# Altium schematic sheet DE-140824.SchDoc: TriacBaeBoard
size A3; Author: eldar6776@hotmail.com; DrawnBy: Eldar Dedic; Organization: JUBERA d.o.o.; Address1: Braće Mulić 81; Address2: 71000 Sarajevo; Address3: Federacija BiH; Address4: Bosna i Hercegovina; DocumentNumber: DE-140824; Revision: 001; SheetNumber: 1; SheetTotal: 2
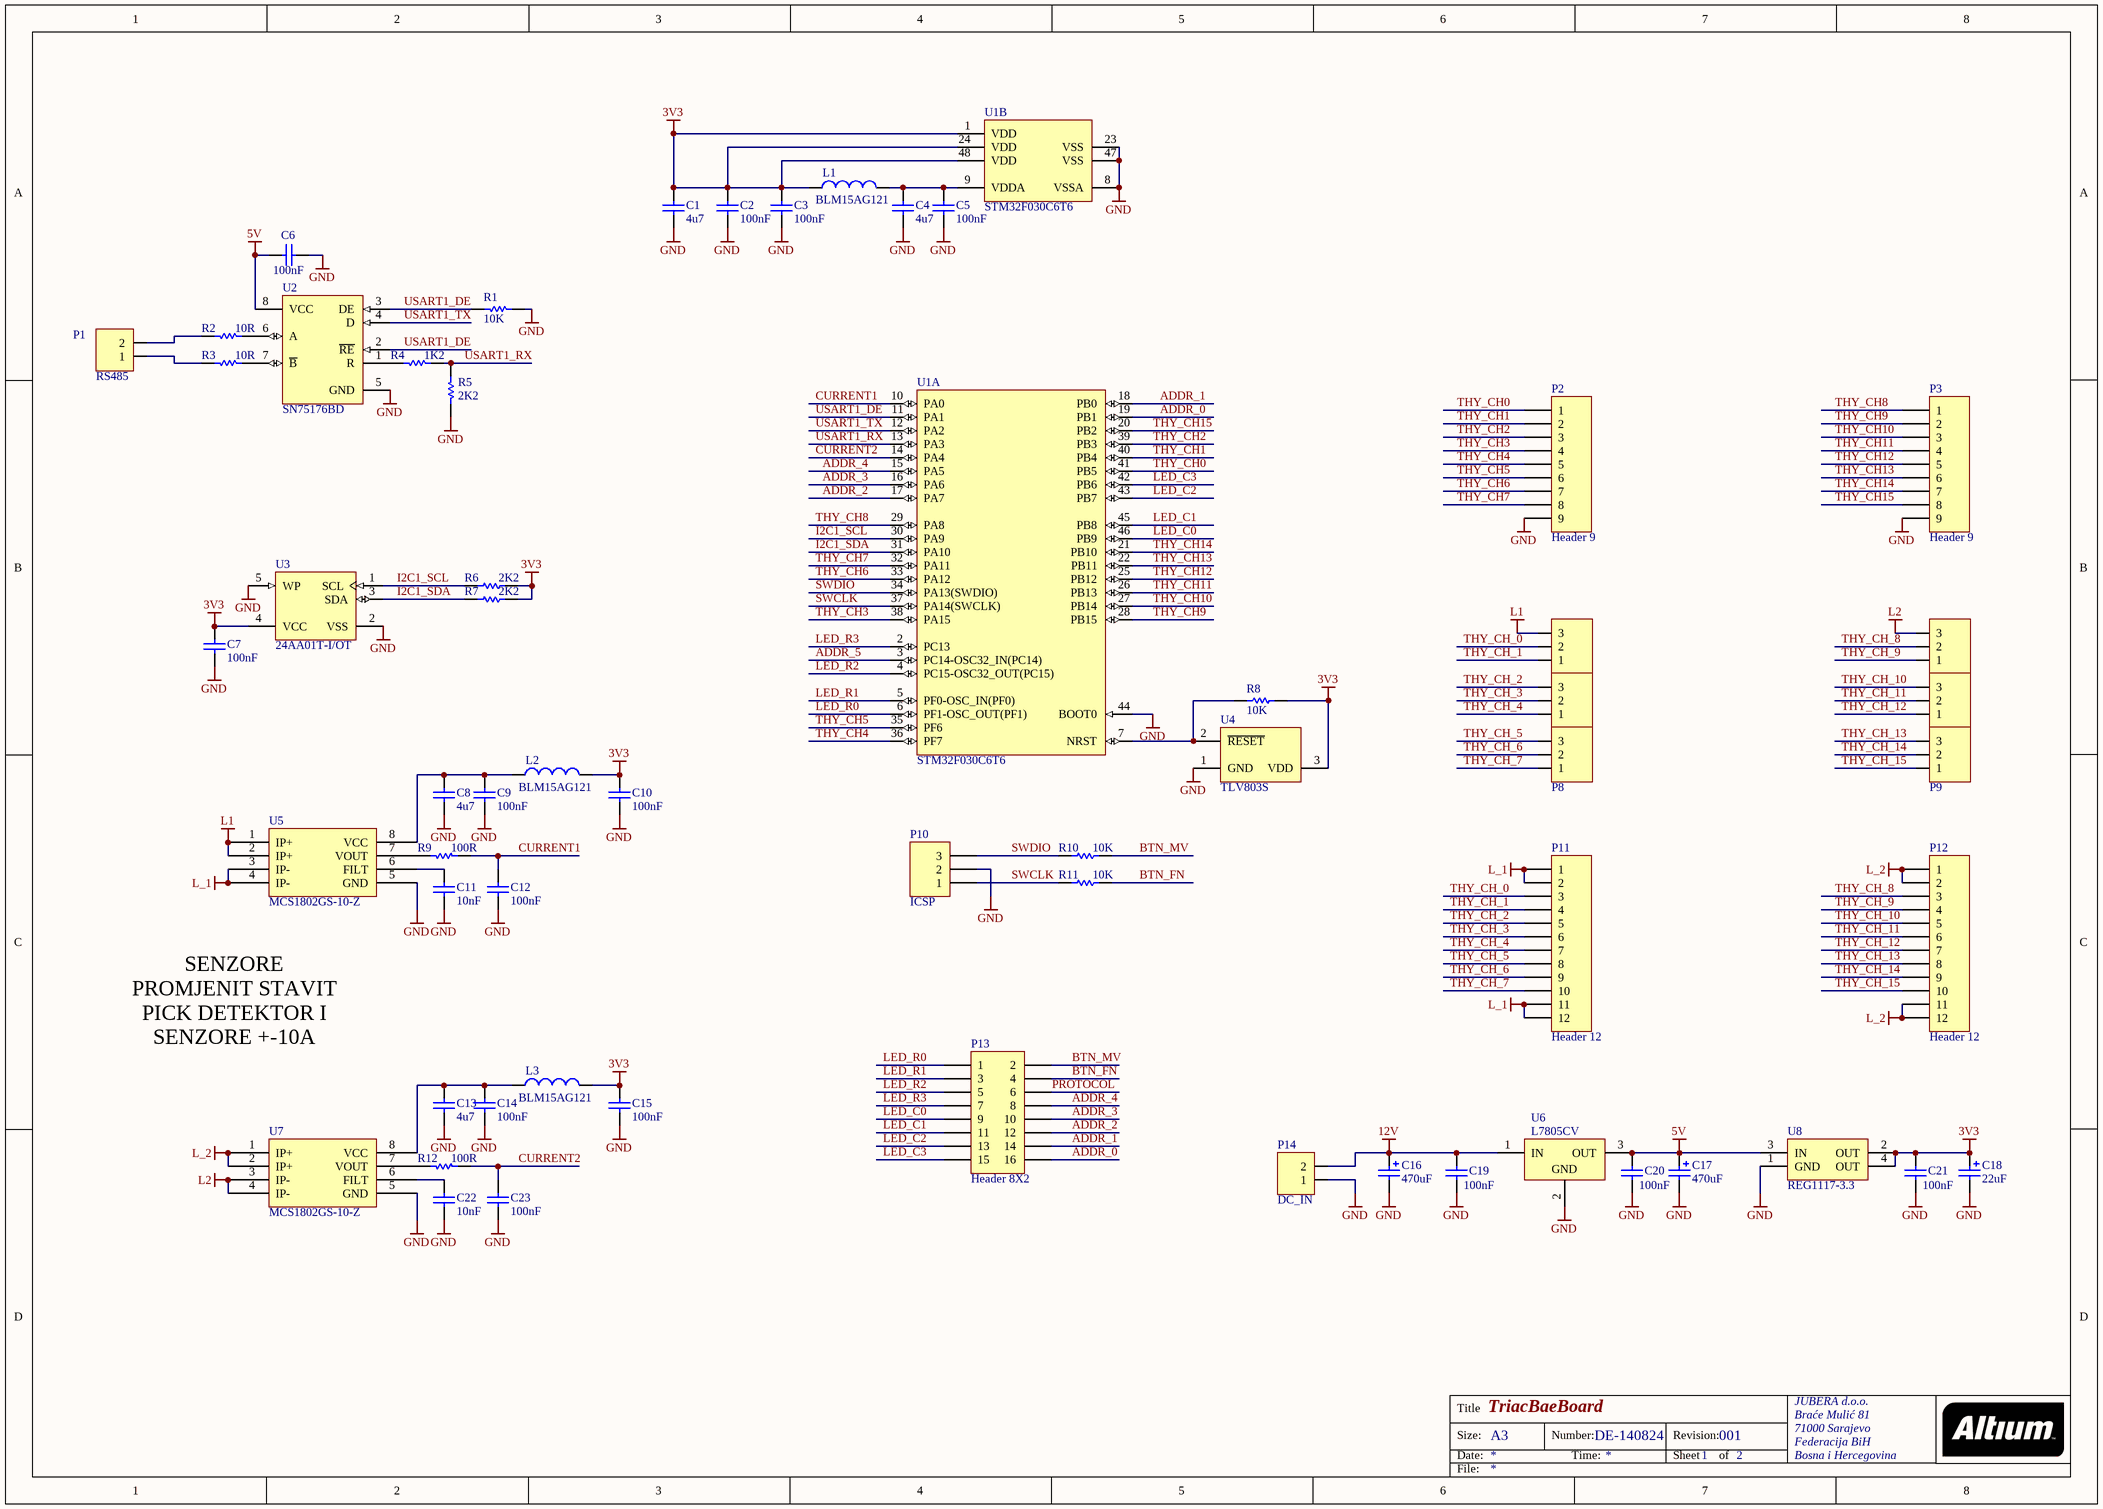
[diagram p0: DE-140824.SchDoc]

## Parts
C1  value 4u7  [0805]  (hidden comment: C0805)
C2  value 100nF  [0603]  (hidden comment: C0603)
C3  value 100nF  [0603]  (hidden comment: C0603)
C4  value 4u7  [0805]  (hidden comment: C0805)
C5  value 100nF  [0603]  (hidden comment: C0603)
C6  100nF  [0603]
C7  value 100nF  [0603]  (hidden comment: C0603)
C8  value 4u7  [0805]  (hidden comment: C0805)
C9  value 100nF  [0603]  (hidden comment: C0603)
C10  value 100nF  [0603]  (hidden comment: C0603)
C11  value 10nF  [0603]  (hidden comment: C0603)
C12  value 100nF  [0603]  (hidden comment: C0603)
C13  value 4u7  [0805]  (hidden comment: C0805)
C14  value 100nF  [0603]  (hidden comment: C0603)
C15  value 100nF  [0603]  (hidden comment: C0603)
C16  470uF  [CAPPR5-10X12.5]
C17  470uF  [CAPPR5-10X12.5]
C18  22uF  [CAPPR2-5X11]
C19  100nF  [0603]
C20  100nF  [0603]
C21  100nF  [0603]
C22  value 10nF  [0603]  (hidden comment: C0603)
C23  value 100nF  [0603]  (hidden comment: C0603)
L1  BLM15AG121  [0402-A]
L2  BLM15AG121  [0402-A]
L3  BLM15AG121  [0402-A]
P1  RS485  [TERMINAL BLOK 2]
P2  Header 9  [HDR1X9]
P3  Header 9  [HDR1X9]
P4  (no value)  [TERMINAL BLOK 3]
P5  (no value)  [TERMINAL BLOK 3]
P6  (no value)  [TERMINAL BLOK 3]
P7  (no value)  [TERMINAL BLOK 3]
P8  (no value)  [TERMINAL BLOK 3]
P9  (no value)  [TERMINAL BLOK 3]
P10  ICSP  [HDR1X3]
P11  Header 12  [HDR1X12]
P12  Header 12  [HDR1X12]
P13  Header 8X2  [HDR2X8]
P14  DC_IN  [TERMINAL BLOK 2]
R1  10K  [ERA-0603]
R2  10R  [ERA-0603]
R3  10R  [ERA-0603]
R4  1K2  [ERA-0603]
R5  2K2  [ERA-0603]
R6  2K2  [ERA-0603]
R7  2K2  [ERA-0603]
R8  10K  [ERA-0603]
R9  100R  [ERA-0603]
R10  10K  [ERA-0603]
R11  10K  [ERA-0603]
R12  100R  [ERA-0603]
U1  STM32F030C6T6  [STM-LQFP48_N]  (parts A,B of 2)
U2  SN75176BD  [D008_N]
U3  24AA01T-I/OT  [SOT-23-OT5_N]
U4  TLV803S  [DBZ3_N]
U5  MCS1802GS-10-Z  [SOIC-SN8_N]
U6  L7805CV  [TO220]
U7  MCS1802GS-10-Z  [SOIC-SN8_N]
U8  REG1117-3.3  [ZZ311]

## Nets
3V3: C1.2 C2.2 C3.2 C7.2 C10.2 C15.2 C18.1 C21.2 L1.1 L2.2 L3.2 R6.2 R7.2 R8.2 U1.1(VDD) U1.24(VDD) U1.48(VDD) U3.4(VCC) U4.3(VDD) U8.2(OUT) U8.4(OUT)
5V: C6.1 C17.1 C20.2 U2.8(VCC) U6.3(OUT) U8.3(IN)
12V: C16.1 C19.2 P14.2 U6.1(IN)
GND: C1.1 C2.1 C3.1 C4.1 C5.1 C6.2 C7.1 C8.1 C9.1 C10.1 C11.1 C12.1 C13.1 C14.1 C15.1 C16.2 C17.2 C18.2 C19.1 C20.1 C21.1 C22.1 C23.1 P2.9 P3.9 P10.2 P14.1 R1.1 R5.2 U1.8(VSSA) U1.23(VSS) U1.44(BOOT0) U1.47(VSS) U2.5(GND) U3.2(VSS) U3.5(WP) U4.1(GND) U5.5(GND) U6.2(GND) U7.5(GND) U8.1(GND)
L1: P4.3 U5.1(IP+) U5.2(IP+)
L2: P5.3 U7.3(IP-) U7.4(IP-)
L_1: P11.1 P11.2 P11.11 P11.12 U5.3(IP-) U5.4(IP-)
L_2: P12.1 P12.2 P12.11 P12.12 U7.1(IP+) U7.2(IP+)
ADDR_0: P13.16 U1.19(PB1)
ADDR_1: P13.14 U1.18(PB0)
ADDR_2: P13.12 U1.17(PA7)
ADDR_3: P13.10 U1.16(PA6)
ADDR_4: P13.8 U1.15(PA5)
ADDR_5: U1.3(PC14-OSC32_IN(PC14))
BTN_FN: P13.4 R11.2
BTN_MV: P13.2 R10.2
CURRENT1: C12.2 R9.1 U1.10(PA0)
CURRENT2: C23.2 R12.1 U1.14(PA4)
I2C1_SCL: R6.1 U1.30(PA9) U3.1(SCL)
I2C1_SDA: R7.1 U1.31(PA10) U3.3(SDA)
LED_C0: P13.9 U1.46(PB9)
LED_C1: P13.11 U1.45(PB8)
LED_C2: P13.13 U1.43(PB7)
LED_C3: P13.15 U1.42(PB6)
LED_R0: P13.1 U1.6(PF1-OSC_OUT(PF1))
LED_R1: P13.3 U1.5(PF0-OSC_IN(PF0))
LED_R2: P13.5 U1.4(PC15-OSC32_OUT(PC15))
LED_R3: P13.7 U1.2(PC13)
PROTOCOL: P13.6
SWCLK: P10.1 R11.1 U1.37(PA14(SWCLK))
SWDIO: P10.3 R10.1 U1.34(PA13(SWDIO))
THY_CH0: P2.1 U1.41(PB5)
THY_CH1: P2.2 U1.40(PB4)
THY_CH2: P2.3 U1.39(PB3)
THY_CH3: P2.4 U1.38(PA15)
THY_CH4: P2.5 U1.36(PF7)
THY_CH5: P2.6 U1.35(PF6)
THY_CH6: P2.7 U1.33(PA12)
THY_CH7: P2.8 U1.32(PA11)
THY_CH8: P3.1 U1.29(PA8)
THY_CH9: P3.2 U1.28(PB15)
THY_CH10: P3.3 U1.27(PB14)
THY_CH11: P3.4 U1.26(PB13)
THY_CH12: P3.5 U1.25(PB12)
THY_CH13: P3.6 U1.22(PB11)
THY_CH14: P3.7 U1.21(PB10)
THY_CH15: P3.8 U1.20(PB2)
THY_CH_0: P4.2 P11.3
THY_CH_1: P4.1 P11.4
THY_CH_2: P6.3 P11.5
THY_CH_3: P6.2 P11.6
THY_CH_4: P6.1 P11.7
THY_CH_5: P8.3 P11.8
THY_CH_6: P8.2 P11.9
THY_CH_7: P8.1 P11.10
THY_CH_8: P5.2 P12.3
THY_CH_9: P5.1 P12.4
THY_CH_10: P7.3 P12.5
THY_CH_11: P7.2 P12.6
THY_CH_12: P7.1 P12.7
THY_CH_13: P9.3 P12.8
THY_CH_14: P9.2 P12.9
THY_CH_15: P9.1 P12.10
USART1_DE: R1.2 U1.11(PA1) U2.2(~{RE}) U2.3(DE)
USART1_RX: R4.1 R5.1 U1.13(PA3)
USART1_TX: U1.12(PA2) U2.4(D)
NetC4_2: C4.2 C5.2 L1.2 U1.9(VDDA)
NetC8_2: C8.2 C9.2 L2.1 U5.8(VCC)
NetC11_2: C11.2 U5.6(FILT)
NetC13_2: C13.2 C14.2 L3.1 U7.8(VCC)
NetC22_2: C22.2 U7.6(FILT)
NetP1_1: P1.1 R3.1
NetP1_2: P1.2 R2.1
NetR2_2: R2.2 U2.6(A)
NetR3_2: R3.2 U2.7(~{B})
NetR4_2: R4.2 U2.1(R)
NetR8_1: R8.1 U1.7(NRST) U4.2(~{RESET})
NetR9_2: R9.2 U5.7(VOUT)
NetR12_2: R12.2 U7.7(VOUT)

## Notes on the sheet
- SENZORE PROMJENIT STAVIT PICK DETEKTOR I SENZORE +-10A
- Title
- Size:
- Date:
- A3
- Number:
- Time:
- Revision:
- Sheet
- of
- File:

## Library data of the parts
C1 C4 C8 C13 = C0805: Ceramic Chip Capacitor - Standard; Note: Footprint corresponds to dimensions for bulk cassette packaging. This case size has tightened tolerances.; Published: 17-Jul-2002; LatestRevisionDate: 19-Mar-2004; LatestRevisionNote: Silkscreen size reduced.; DatasheetDocument: Mar-2001; PackageDocument: Mar-2001; PackageReference: 0805; Publisher: Altium Limited; Code_JEITA: 0805; Code_IPC: 2012[0805]; ComponentLink1Description: Manufacturer Link; ComponentLink1URL: http://www.kemet.com/; ComponentLink2Description: Datasheet; ComponentLink2URL: http://www.kemet.com/kemet/web/homepage/kechome.nsf/vapubfilesname/F3102TA.pdf/$file/F3102TA.pdf
C2 C3 C5-C7 C9-C12 C14 C15 C19-C23 = C0603: Ceramic Chip Capacitor - Standard; Note: Footprint corresponds to dimensions for bulk cassette packaging. This case size has tightened tolerances.; Published: 17-Jul-2002; LatestRevisionDate: 19-Mar-2004; LatestRevisionNote: Silkscreen size reduced.; DatasheetDocument: Mar-2001; PackageDocument: Mar-2001; PackageReference: 0603; Publisher: Altium Limited; Code_JEITA: 0603; Code_IPC: 1608 [0603]; ComponentLink1Description: Manufacturer Link; ComponentLink1URL: http://www.kemet.com/; ComponentLink2Description: Datasheet; ComponentLink2URL: http://www.kemet.com/kemet/web/homepage/kechome.nsf/vapubfilesname/F3102TA.pdf/$file/F3102TA.pdf
  C6 C19-C21: Value: 100nF
C16 C17 = EKA00DC347E00: Aluminum Electrolytic Capacitor, Radial Style with Long Leads: 470uF, 25V; Note: Refer to Manufacturer's Data Sheets for other lead formations; DrillSize: Nominal, Rounded To The Nearest 0.1mm; Published: 19-Mar-2004; DatasheetDocument: 20-Feb-2001; PackageReference: CAPPR5-10X12.5; Publisher: Altium Limited; ComponentLink1Description: Manufacturer Link; ComponentLink1URL: http://www.vishay.com/; ComponentLink2Description: Datasheet; ComponentLink2URL: http://www.vishay.com/docs/25014/eka.pdf; Value: 470uF
C18 = EKA00AA247F00: Aluminum Electrolytic Capacitor, Radial Style with Long Leads: 47uF, 35V; Note: Refer to Manufacturer's Data Sheets for other lead formations; DrillSize: Nominal, Rounded To The Nearest 0.1mm; Published: 19-Mar-2004; DatasheetDocument: 20-Feb-2001; PackageReference: CAPPR2-5X11; Publisher: Altium Limited; ComponentLink1Description: Manufacturer Link; ComponentLink1URL: http://www.vishay.com/; ComponentLink2Description: Datasheet; ComponentLink2URL: http://www.vishay.com/docs/25014/eka.pdf; Value: 47uF
L1-L3 = Chip inductor: SMD chip inductor; Code_IEC: 1005; Published: 8-Jun-2000; LatestRevisionDate: 29-May-2009; LatestRevisionNote: IPC-7351 Footprint Added.; PackageReference: 0402-A; Publisher: Altium Limited; PackageDescription: Chip Inductor; Code_JEITA: 0402
P1 P14 = TERMINAL BLOK 2: Terminal blok konektor 3,5 mm
P2 P3 = Header 9: Header, 9-Pin; LatestRevisionDate: 17-Jul-2002; LatestRevisionNote: Re-released for DXP Platform.; Publisher: Altium Limited
P4-P9 = TERMINAL BLOK 3: 3 pinski terminal blok konektor
P10 = Header 3: Header, 3-Pin; LatestRevisionDate: 17-Jul-2002; LatestRevisionNote: Re-released for DXP Platform.; Publisher: Altium Limited
P11 P12 = Header 12: Header, 12-Pin; LatestRevisionDate: 17-Jul-2002; LatestRevisionNote: Re-released for DXP Platform.; Publisher: Altium Limited
P13 = Header 8X2: Header, 8-Pin, Dual row; LatestRevisionDate: 17-Jul-2002; LatestRevisionNote: Re-released for DXP Platform.; Publisher: Altium Limited
R1-R5 R9 R12 = ERAV: Metal Film Thermosensitive Chip Resistor, 0.56 Ohm to 10k Ohm Range, 5% Tolerance, 0603 Size, 0.063 W; Note: If flow soldering, adjust pad width of PCB Footprint to 0.7 - 0.8 times the width of the resistor.; Published: 17-Dec-2003; LatestRevisionDate: 19-Mar-2004; LatestRevisionNote: Silkscreen size reduced.; PackageDocument: Mar-2003; PackageReference: ERA-0603; Publisher: Altium Limited; Code_IPC: 1608 [0603]; ComponentLink1Description: Manufacturer Link; ComponentLink1URL: http://www.panasonic.com/industrial/components/resistive_products.htm; ComponentLink2Description: Datasheet; ComponentLink2URL: http://www.panasonic.com/industrial/components/pdf/AOF0000CE1.pdf
R6-R8 R10 R11 = ERA3Y: Rectangular Thick Film Chip Resistor, 10 Ohm to 330k Ohm Range, 0.1% and 0.5% Tolerance, 0603 Size, 0.063 W; Note: If flow soldering, adjust pad width of PCB Footprint to 0.7 - 0.8 times the width of the resistor.; Published: 17-Dec-2003; LatestRevisionDate: 19-Mar-2004; LatestRevisionNote: Silkscreen size reduced.; PackageDocument: Mar-2003; PackageReference: ERA-0603; Publisher: Altium Limited; Code_IPC: 1608 [0603]; ComponentLink1Description: Manufacturer Link; ComponentLink1URL: http://www.panasonic.com/industrial/components/resistive_products.htm; ComponentLink2Description: Datasheet; ComponentLink2URL: http://www.panasonic.com/industrial/components/pdf/AOA0000CE8.pdf
U1 = STM32F030C6T6: ARM Cortex-M0 32-bit MCU, 32 KB Flash, 4 KB Internal RAM, 39 I/Os, 48-pin LQFP, -40 to 85 degC, Tray; FLASH Size (Prog) (kB): 32; I/Os (High Current): 39; Internal RAM Size (kB): 4; Operating Frequency(F) (Processor speed) (MHz): 48; Supply Voltage(Vcc) min (V): 2.4; DatasheetVersion: Rev. 1; PackageVersion: Rev. 6, 06/2013; PackageReference: LQFP48; PackageDescription: 48-Pin Low Profile Quad Flat Package, 7 x 7 mm Body, 0.5 mm Pitch; Supplier 1: Digi-Key; Supplier Part Number 1: 497-14042-ND; Supplier 2: Newark; Supplier Part Number 2: 06X3646; Supplier 3: Mouser; Supplier Part Number 3: 511-STM32F030C6T6; Core: ARM Cortex-M0; Packing: Tray; Mounting Technology: Surface Mount; PartNumber: STM32F030C6T6; ComponentLink1Description: Manufacturer URL; ComponentLink1URL: http://www.st.com/web/en/home.html; ComponentLink2Description: Datasheet; ComponentLink2URL: http://www.st.com/st-web-ui/static/active/en/resource/technical/document/datasheet/DM00088500.pdf; ComponentLink3Description: Package Specification; ComponentLink3URL: http://www.st.com/st-web-ui/static/active/en/resource/technical/document/datasheet/DM00058181.pdf
U2 = SN75176BD: Differential Bus Transceiver; Note: Receiver Hysteresis of 50mV Typical; Published: 15-May-2002; LatestRevisionDate: 13-Apr-2006; LatestRevisionNote: IPC-7351 Footprint Added.; DatasheetVersion: Sep-1989; PackageVersion: Jan-1998; PackageReference: D008; Publisher: Altium Limited; PackageDescription: 8-Pin Small Outline Integrated Circuit 1.27 mm Pitch; Code_IPC: SOIC127P600-8; ComponentLink1Description: Manufacturer Link; ComponentLink1URL: http://www.ti.com/; ComponentLink2Description: Datasheet; ComponentLink2URL: http://www-s.ti.com/sc/ds/sn75176b.pdf
U3 = 24AA01T-I/OT: 1Kbit, 400kHz, 1.8V, I2C Serial EEPROM, 5-Pin SOT-23, Industrial Temperature, Tape and Reel; Published: 29-Jan-2009; DatasheetVersion: revJ, Jan-2009; PackageVersion: revBB, Aug-2009; PackageReference: SOT-23-OT5; Publisher: Altium Limited; PackageDescription: 5-Lead Plastic Small Outline Transistor (OT) [SOT-23]; Supplier 1: Digi-Key; Supplier Part Number 1: 24AA01T-I/OTTR-ND; Supplier 2: Digi-Key; Supplier Part Number 2: 24AA01T-I/OTCT-ND; Supplier 3: Digi-Key; Supplier Part Number 3: 24AA01T-I/OTDKR-ND; Supplier 4: Farnell; Supplier Part Number 4: 1331269; Code_IPC: SOT23-5; ComponentLink1Description: Datasheet; ComponentLink1URL: http://ww1.microchip.com/downloads/en/DeviceDoc/21711J.pdf; ComponentLink2Description: Packaging Specification; ComponentLink2URL: http://www.microchip.com/stellent/groups/techpub_sg/documents/packagingspec/en012702.pdf; ComponentLink3Description: Microchip.com Home; ComponentLink3URL: http://www.microchip.com/
U4 = TLV803MDBZR: Voltage Supervisor with Active-Low, Open Drain Reset, 1 Supply Monitored, -40 to 125 degC, 3-pin SOT-23 (DBZ), Green (RoHS & no Sb/Br); Manufacturer: Texas Instruments; # of supplies monitored: 1; Iq(Typ)(uA): 9; Output Driver Type / Reset Output: Active-low, Open-drain; Rating: Catalog; Reset Threshold Accuracy(%): 2; SubFamily: Supervisor and Reset IC; Threshold Voltage 1 (typ)(Typ)(V): 4.38; Time Delay(ms): 200; VCC(Max)(V): 6; VCC(Min)(V): 1.1; DatasheetVersion: SBVS157B; PackageVersion: revB, Apr-2005; PackageReference: DBZ3; PackageDescription: 3-Pin Plastic Small-Outline Package, 0.95 mm Pitch, 2.4 mm Lead Span; Supplier 1: Digi-Key; Supplier Part Number 1: 296-29194-2-ND; Supplier 2: Digi-Key; Supplier Part Number 2: 296-29194-1-ND; Supplier 3: Digi-Key; Supplier Part Number 3: 296-29194-6-ND; Supplier 4: Newark; Supplier Part Number 4: 58T0286; Supplier 5: Mouser; Supplier Part Number 5: 595-TLV803MDBZR; Mounting Technology: Surface Mount; Code_JEDEC: TO-236-AB; PartNumber: TLV803MDBZR; ComponentLink1Description: Datasheet; ComponentLink1URL: http://www.ti.com/general/docs/lit/getliterature.tsp?genericPartNumber=TLV803M&fileType=pdf
U5 U7 = ACS71240
U6 = L7805CV: Positive Voltage Regulator, 5V, 3-Pin TO-220; DatasheetVersion: Nov-2011; PackageVersion: ver3.0; PackageReference: TO220; PackageDescription: TO, Thru-Hole, Vertical, Heatsink Mounted; 3 In-Line Leads; Pitch 2.54 mm; PartNumber: L7805CV; ComponentLink1Description: Manufacturer URL; ComponentLink1URL: http://www.st.com; ComponentLink2Description: Datasheet; ComponentLink2URL: http://www.st.com/internet/com/TECHNICAL_RESOURCES/TECHNICAL_LITERATURE/DATASHEET/CD00000444.pdf; ComponentLink3Description: Package Specification; ComponentLink3URL: http://www.st.com/internet/com/TECHNICAL_RESOURCES/TECHNICAL_LITERATURE/PACKAGE_INFORMATION/CD00004649.pdf
U8 = REG1117-3.3: 800mA and 1A Low Dropout Positive Regulator 2.85V, 3.3V, 5V, and Adjustable; Published: 8-Jun-2000; LatestRevisionDate: 17-Jul-2002; LatestRevisionNote: Re-released for DXP Platform.; DatasheetVersion: Sep-1997; PackageVersion: revC; PackageReference: ZZ311; Publisher: Altium Limited; PackageDescription: SOT-223/SC-73; 4 Leads; Body 6.7 x 7.3 mm, inc. leads (LxW max); ComponentLink1Description: Manufacturer Link; ComponentLink1URL: http://www.ti.com/; ComponentLink2Description: Datasheet; ComponentLink2URL: http://www-s.ti.com/sc/ds/REG1117.pdf